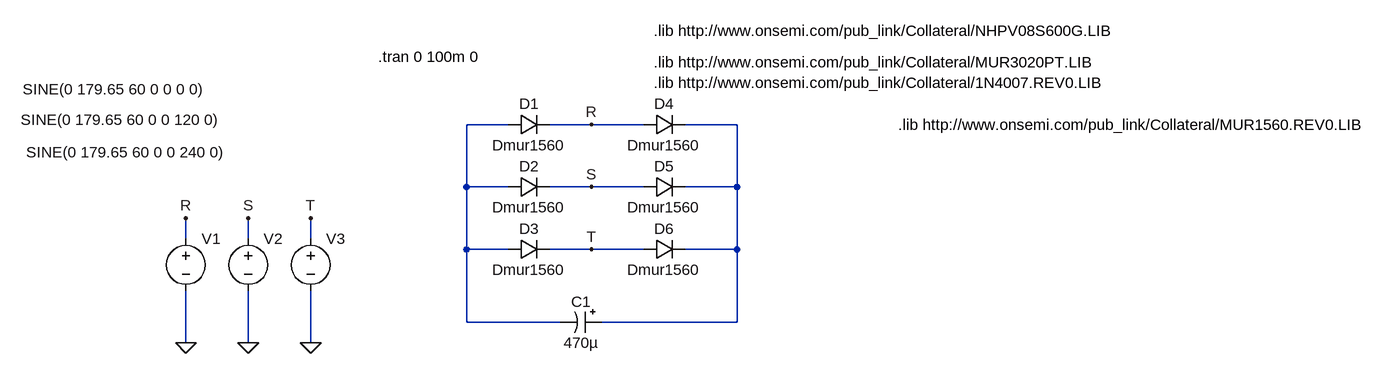
[diagram p0: schematic rect.asc]
rect.asc, the LTspice schematic file:
Version 4
SHEET 1 1928 1144
WIRE 464 -64 400 -64
WIRE 592 -64 528 -64
WIRE 672 -64 592 -64
WIRE 816 -64 736 -64
WIRE 400 32 400 -64
WIRE 464 32 400 32
WIRE 592 32 528 32
WIRE 672 32 592 32
WIRE 816 32 816 -64
WIRE 816 32 736 32
WIRE -32 112 -32 80
WIRE 64 112 64 80
WIRE 160 112 160 80
WIRE 400 128 400 32
WIRE 464 128 400 128
WIRE 592 128 528 128
WIRE 672 128 592 128
WIRE 816 128 816 32
WIRE 816 128 736 128
WIRE 400 240 400 128
WIRE 544 240 400 240
WIRE 816 240 816 128
WIRE 816 240 608 240
WIRE -32 272 -32 192
WIRE 64 272 64 192
WIRE 160 272 160 192
FLAG -32 272 0
FLAG -32 80 R
FLAG 592 -64 R
FLAG 592 32 S
FLAG 592 128 T
FLAG 64 272 0
FLAG 64 80 S
FLAG 160 272 0
FLAG 160 80 T
SYMBOL voltage -32 96 R0
WINDOW 3 -251 -214 Left 2
WINDOW 123 0 0 Left 2
WINDOW 39 0 0 Left 2
SYMATTR Value SINE(0 179.65 60 0 0 0 0)
SYMATTR InstName V1
SYMBOL diode 464 -48 R270
WINDOW 0 32 32 VTop 2
WINDOW 3 0 32 VBottom 2
SYMATTR InstName D1
SYMATTR Value Dmur1560
SYMBOL diode 464 48 R270
WINDOW 0 32 32 VTop 2
WINDOW 3 0 32 VBottom 2
SYMATTR InstName D2
SYMATTR Value Dmur1560
SYMBOL diode 464 144 R270
WINDOW 0 32 32 VTop 2
WINDOW 3 0 32 VBottom 2
SYMATTR InstName D3
SYMATTR Value Dmur1560
SYMBOL diode 672 -48 R270
WINDOW 0 32 32 VTop 2
WINDOW 3 0 32 VBottom 2
SYMATTR InstName D4
SYMATTR Value Dmur1560
SYMBOL diode 672 48 R270
WINDOW 0 32 32 VTop 2
WINDOW 3 0 32 VBottom 2
SYMATTR InstName D5
SYMATTR Value Dmur1560
SYMBOL diode 672 144 R270
WINDOW 0 32 32 VTop 2
WINDOW 3 0 32 VBottom 2
SYMATTR InstName D6
SYMATTR Value Dmur1560
SYMBOL polcap 608 224 R90
WINDOW 0 0 32 VBottom 2
WINDOW 3 32 32 VTop 2
SYMATTR InstName C1
SYMATTR Value 470µ
SYMATTR Description Capacitor
SYMATTR Type cap
SYMATTR SpiceLine V=400 Irms=1.33 Rser=0.047 Lser=0
SYMBOL voltage 64 96 R0
WINDOW 3 -350 -167 Left 2
WINDOW 123 0 0 Left 2
WINDOW 39 0 0 Left 2
SYMATTR Value SINE(0 179.65 60 0 0 120 0)
SYMATTR InstName V2
SYMBOL voltage 160 96 R0
WINDOW 3 -438 -117 Left 2
WINDOW 123 0 0 Left 2
WINDOW 39 0 0 Left 2
SYMATTR Value SINE(0 179.65 60 0 0 240 0)
SYMATTR InstName V3
TEXT 264 -168 Left 2 !.tran 0 100m 0
TEXT 688 -208 Left 2 !.lib http://www.onsemi.com/pub_link/Collateral/NHPV08S600G.LIB
TEXT 688 -160 Left 2 !.lib http://www.onsemi.com/pub_link/Collateral/MUR3020PT.LIB
TEXT 688 -128 Left 2 !.lib http://www.onsemi.com/pub_link/Collateral/1N4007.REV0.LIB
TEXT 1064 -64 Left 2 !.lib http://www.onsemi.com/pub_link/Collateral/MUR1560.REV0.LIB

The netlist it stands for:
* rect.asc
V1 R 0 SINE(0 179.65 60 0 0 0 0)
D1 N001 R Dmur1560
D2 N001 S Dmur1560
D3 N001 T Dmur1560
D4 R N002 Dmur1560
D5 S N002 Dmur1560
D6 T N002 Dmur1560
C1 N002 N001 470µ V=400 Irms=1.33 Rser=0.047 Lser=0
V2 S 0 SINE(0 179.65 60 0 0 120 0)
V3 T 0 SINE(0 179.65 60 0 0 240 0)
.model D D
.lib standard.dio
.tran 0 100m 0
.lib http://www.onsemi.com/pub_link/Collateral/NHPV08S600G.LIB
.lib http://www.onsemi.com/pub_link/Collateral/MUR3020PT.LIB
.lib http://www.onsemi.com/pub_link/Collateral/1N4007.REV0.LIB
.lib http://www.onsemi.com/pub_link/Collateral/MUR1560.REV0.LIB
.backanno
.end

* Results of the author's LTspice run, read from the files saved beside the schematic
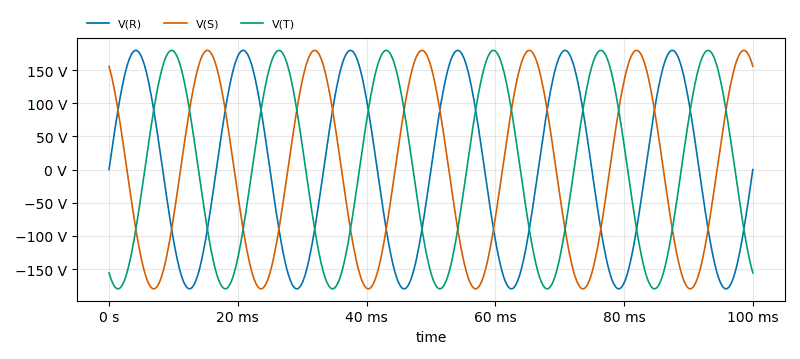
[diagram p1: Transient Analysis of rect.asc, plotted from the saved traces]
* Transient Analysis, 1 run:
*   V(R): min -179.6 V, max 179.6 V, average -407.7 µV, rms 127 V, last 0 V
*   V(S): min -179.6 V, max 179.6 V, average 374.5 µV, rms 127 V, last 155.6 V
*   V(T): min -179.6 V, max 179.6 V, average 33.03 µV, rms 127 V, last -155.6 V